# EasyEDA Pro project 电机控制板_v2.1.epro, board PCB11
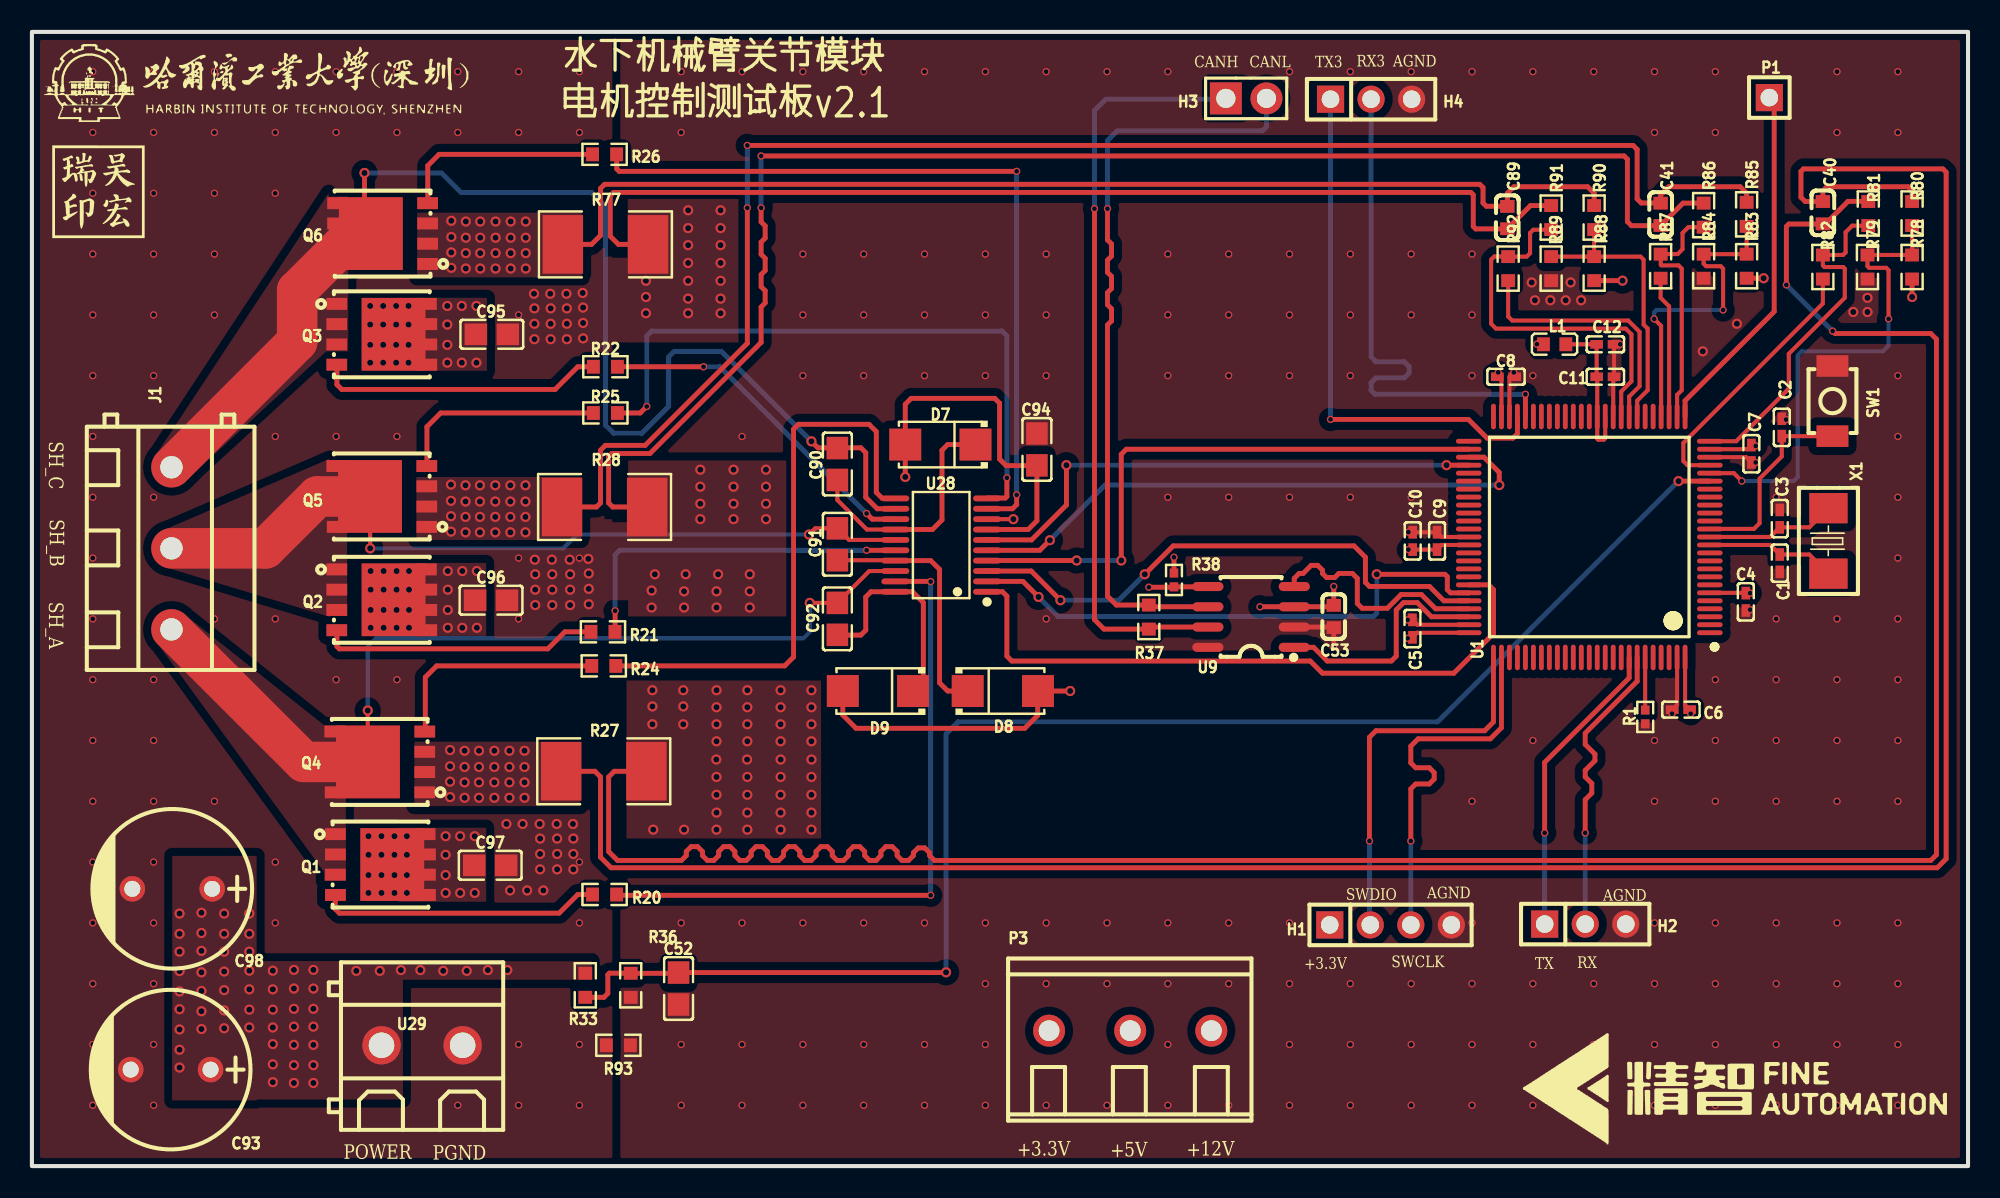
[diagram p3: board, top side]
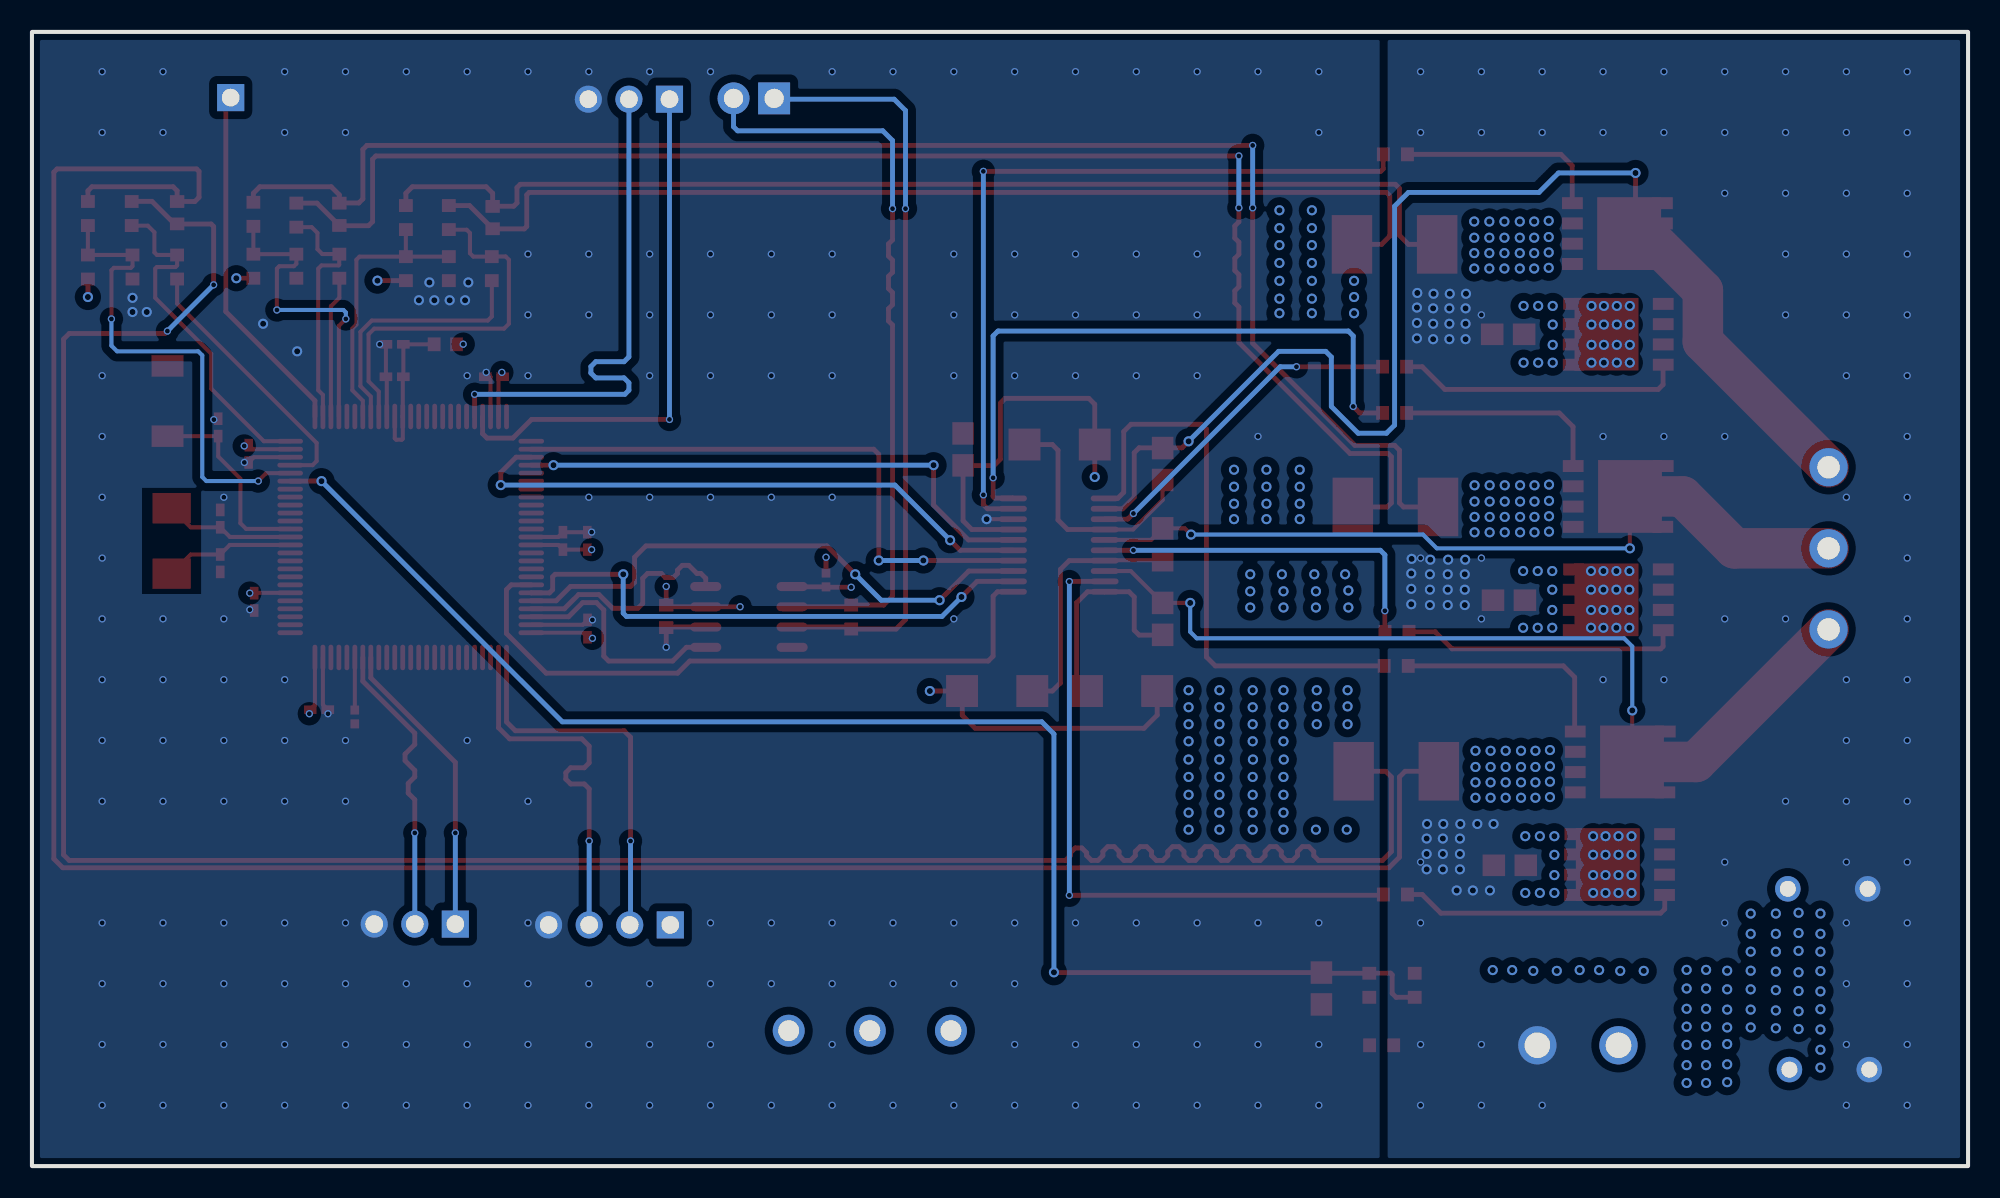
[diagram p4: board, bottom side, seen from below]

Outline 121.26 x 71.07 mm; copper layers: Top Layer, GND, PWR, Bottom Layer. Coordinates in mm from the lower left corner of the outline.
Outline path: rectangle 0,71.07 121.26,0
Stack: Top Layer 0.035mm 外层铜厚1oz / Dielectric1 0.2104mm 7628 RC49% 8.6mil / GND 0.0152mm 内层铜厚 / Dielectric2 1.065mm 1.1mm H/HOZ 含铜 / PWR 0.0152mm 内层铜厚 / Dielectric3 0.2104mm 7628 RC49% 8.6mil / Bottom Layer 0.035mm 外层铜厚1oz

## Design rules (mm)
net RX: USART
net TX: USART
net SWCLK: SWD
net SWDIO: SWD
net CAN_TX: CAN_TR
net CAN_RX: CAN_TR
net OSC_OUT: OSC
net OSC_IN: OSC
net CANH: CAN_HL
net CANL: CAN_HL
template: 自定义配置
spacing copperThickness1oz (default): track to track 0.102, other pairs 0.152 to 0.3
spacing copperThickness2oz: track to track 0.203, other pairs 0.152 to 0.3
track width copperThickness1oz (default): min 0.127, default 0.305, max 2.54
track width copperThickness2oz: min 0.203, default 0.254, max 2.54
differential pair differentialPair (default): width min 0.127, default 0.254, max 2.54; gap min 0.152, default 0.152
via viaSize (default): diameter min 0.254, default 0.457, max 10; hole min 0.3, default 0.305, max 6.299

## Placement (name value [footprint] x y rotation side)
C1  30pF  [C0402]  109.47 37.78 270 top
C2  100nF  [C0402]  109.59 46.29 270 top
C3  30pF  [C0402]  109.47 40.57 90 top
C4  100nF  [C0402]  107.34 35.36 90 top
C5  100nF  [C0402]  86.46 33.68 270 top
C6  100nF  [C0402]  103.28 28.6 0 top
C7  100nF  [C0402]  107.69 44.64 90 top
C8  100nF  [C0402]  92.32 49.46 180 top
C9  100nF  [C0402]  88 39.17 270 top
C10  4.7uF  [C0402]  86.48 39.17 270 top
C11  100nF  [C0402]  98.54 49.46 180 top
C12  1uF  [C0402]  98.54 51.49 180 top
C40  1nF  [C0603]  112.17 59.74 90 top
C41  1nF  [C0603]  102.01 59.64 90 top
C52  100nF  [C0805]  40.5 11.13 90 top
C53  100nF  [C0603]  81.53 34.44 90 top
C89  1nF  [C0603]  92.41 59.44 90 top
C90  200nF  [C0805]  50.44 43.99 270 top
C91  200nF  [C0805]  50.44 38.96 270 top
C92  200nF  [C0805]  50.44 34.29 270 top
C93  100uF  [CAP-TH_BD10.0-P5.00-D0.6-FD]  8.69 6.05 180 top
C94  10uF  [C0805]  62.94 44.91 90 top
C95  220nF  [C0805]  28.8 52.12 0 top
C96  220nF  [C0805]  28.75 35.46 0 top
C97  220nF  [C0805]  28.7 18.85 0 top
C98  100uF  [CAP-TH_BD10.0-P5.00-D0.6-FD]  8.79 17.37 180 top
D7  ES1G  [SMA_L4.3-W2.6-LS5.2-RD]  56.9 45.21 180 top
D8  ES1G  [SMA_L4.3-W2.6-LS5.2-RD]  60.81 29.77 0 top
D9  ES1G  [SMA_L4.3-W2.6-LS5.2-RD]  52.98 29.77 180 top
H1  PZ254V-11-04P  [HDR-TH_4P-P2.54-V-M]  85.09 15.11 0 top
H2  PZ254V-11-03P  [HDR-TH_3P-P2.54-V-M]  97.28 15.16 0 top
H3  PZ254V-11-02P  [HDR-TH_2P-P2.54-V-M]  76.05 66.9 0 top
H4  PZ254V-11-03P  [HDR-TH_3P-P2.54-V-M]  83.87 66.85 0 top
J1  KF128-5.08-3P-AA  [CONN-TH_3P-P5.08_KF128-5.08-3P]  8.74 38.71 270 top
L1  GZ1608D601TF  [L0603]  95.37 51.49 0 top
P1  2.54-1*1P针  [HDR-TH_1P-P2.54-V-M]  108.81 66.95 180 top
P3  WJ500V-5.08-3P  [CONN-TH_3P-P5.00_WJ500V-5.08-3P]  68.78 8.48 180 top
Q1  BSC0702LS  [PG-TDSON-8_L5.0-W6.0-P1.27-BL-EP]  21.83 18.89 270 top
Q2  BSC0702LS  [PG-TDSON-8_L5.0-W6.0-P1.27-BL-EP]  21.91 35.48 270 top
Q3  BSC0702LS  [PG-TDSON-8_L5.0-W6.0-P1.27-BL-EP]  21.91 52.12 270 top
Q4  BSC0702LS  [PG-TDSON-8_L5.0-W6.0-P1.27-BL-EP]  21.78 25.32 90 top
Q5  BSC0702LS  [PG-TDSON-8_L5.0-W6.0-P1.27-BL-EP]  21.91 41.96 90 top
Q6  BSC0702LS  [PG-TDSON-8_L5.0-W6.0-P1.27-BL-EP]  21.96 58.43 90 top
R1  10kΩ  [R0402]  101.04 28.14 270 top
R20  33Ω  [R0603]  35.86 17.02 180 top
R21  33Ω  [R0603]  35.76 33.48 180 top
R22  33Ω  [R0603]  35.92 50.09 180 top
R24  33Ω  [R0603]  35.81 31.34 180 top
R25  33Ω  [R0603]  35.92 47.19 180 top
R26  33Ω  [R0603]  35.86 63.4 180 top
R27  1mΩ  [RES-SMD_L6.4-W3.4]  35.81 24.74 180 top
R28  1mΩ  [RES-SMD_L6.4-W3.4]  35.86 41.3 180 top
R33  75kΩ  [R0603]  34.66 11.33 90 top
R36  3kΩ  [R0603]  37.5 11.33 90 top
R37  120Ω  [R0603]  69.95 34.4 270 top
R38  510Ω  [R0402]  71.53 36.73 90 top
R77  1mΩ  [RES-SMD_L6.4-W3.4]  35.92 57.76 180 top
R78  22kΩ  [R0603]  117.75 56.34 270 top
R79  22kΩ  [R0603]  114.96 56.34 90 top
R80  1.5kΩ  [R0603]  117.75 59.69 270 top
R81  1.5kΩ  [R0603]  115.01 59.69 270 top
R82  11kΩ  [R0603]  112.17 56.34 90 top
R83  22kΩ  [R0603]  107.39 56.39 270 top
R84  22kΩ  [R0603]  104.7 56.39 90 top
R85  1.5kΩ  [R0603]  107.39 59.64 270 top
R86  1.5kΩ  [R0603]  104.7 59.59 270 top
R87  11kΩ  [R0603]  102.01 56.39 90 top
R88  22kΩ  [R0603]  97.84 56.24 270 top
R89  22kΩ  [R0603]  95.15 56.24 90 top
R90  1.5kΩ  [R0603]  97.84 59.44 270 top
R91  1.5kΩ  [R0603]  95.15 59.44 270 top
R92  11kΩ  [R0603]  92.46 56.24 90 top
R93  0Ω  [R0603]  36.73 7.57 0 top
SW1  TS-1185-B-B-B-A  [SW-SMD_L4.0-W3.0-LS5.0]  112.77 47.94 270 top
U1  STM32G474VET6  [LQFP-100_L14.0-W14.0-P0.50-LS16.0-BL]  97.54 39.42 90 top
U9  TJA1050T/CM,118  [SOIC-8_L5.0-W4.0-P1.27-LS6.0-BL]  76.35 34.41 90 top
U28  FD6288T  [TSSOP-20_L6.5-W4.4-P0.65-LS6.4-BL]  56.95 38.91 90 top
U29  KF128-5.08-2P-AA  [CONN-TH_P5.08_KF128-5.08-2P]  24.44 7.57 0 top
X1  8MHz  [CRYSTAL-SMD_L5.0-W3.2]  112.51 39.17 270 top

## Footprints (pads in the part's own frame, mm; a bottom-side part is the same pattern mirrored in y, then rotated)
C0402
  rect 0.79x0.54 smd: 1(-0.545,0) 2(0.545,0)
C0603
  rect 0.8x0.9 smd: 1(-0.7,0) 2(0.7,0)
C0805
  rect 1.41x1.35 smd: 1(-1,0) 2(1,0)
CAP-TH_BD10.0-P5.00-D0.6-FD
  round 1.6 hole 1: 1(-2.5,0) 2(2.5,0)
CONN-TH_3P-P5.00_WJ500V-5.08-3P
  round 2 hole 1.3: 1(-5.08,0) 2(0,0) 3(5.08,0)
CONN-TH_3P-P5.08_KF128-5.08-3P
  round 2.4 hole 1.4: 1(-5.08,0) 2(0,0) 3(5.08,0)
CONN-TH_P5.08_KF128-5.08-2P
  round 2.4 hole 1.6: 1(-2.54,0) 2(2.54,0)
CRYSTAL-SMD_L5.0-W3.2
  rect 1.9x2.4 smd: 1(-2.05,0) 2(2.05,0)
HDR-TH_1P-P2.54-V-M
  rect 1.7x1.7 hole 1.1: 1(0,0)
HDR-TH_2P-P2.54-V-M
  rect 2x2 hole 1.2: 1(-1.27,0)
  round 2 hole 1.2: 2(1.27,0)
HDR-TH_3P-P2.54-V-M
  rect 1.7x1.7 hole 1.1: 1(-2.54,0)
  round 1.7 hole 1.1: 2(0,0) 3(2.54,0)
HDR-TH_4P-P2.54-V-M
  rect 1.7x1.7 hole 1.1: 1(-3.81,0)
  round 1.7 hole 1.1: 2(-1.27,0) 3(1.27,0) 4(3.81,0)
L0603
  rect 0.8x0.864 smd: 1(-0.7,0) 2(0.7,0)
LQFP-100_L14.0-W14.0-P0.50-LS16.0-BL
  oval 0.3x1.6 smd: 1(-6,-7.55) 2(-5.5,-7.55) 3(-5,-7.55) 4(-4.5,-7.55) 5(-4,-7.55) 6(-3.5,-7.55) 7(-3,-7.55) 8(-2.5,-7.55) 9(-2,-7.55) 10(-1.5,-7.55) 11(-1,-7.55) 12(-0.5,-7.55) 13(0,-7.55) 14(0.5,-7.55) 15(1,-7.55) 16(1.5,-7.55) 17(2,-7.55) 18(2.5,-7.55) 19(3,-7.55) 20(3.5,-7.55) 21(4,-7.55) 22(4.5,-7.55) 23(5,-7.55) 24(5.5,-7.55) 25(6,-7.55) 51(6,7.55) 52(5.5,7.55) 53(5,7.55) 54(4.5,7.55) 55(4,7.55) 56(3.5,7.55) 57(3,7.55) 58(2.5,7.55) 59(2,7.55) 60(1.5,7.55) 61(1,7.55) 62(0.5,7.55) 63(0,7.55) 64(-0.5,7.55) 65(-1,7.55) 66(-1.5,7.55) 67(-2,7.55) 68(-2.5,7.55) 69(-3,7.55) 70(-3.5,7.55) 71(-4,7.55) 72(-4.5,7.55) 73(-5,7.55) 74(-5.5,7.55) 75(-6,7.55)
  oval 1.6x0.3 smd: 26(7.55,-6) 27(7.55,-5.5) 28(7.55,-5) 29(7.55,-4.5) 30(7.55,-4) 31(7.55,-3.5) 32(7.55,-3) 33(7.55,-2.5) 34(7.55,-2) 35(7.55,-1.5) 36(7.55,-1) 37(7.55,-0.5) 38(7.55,0) 39(7.55,0.5) 40(7.55,1) 41(7.55,1.5) 42(7.55,2) 43(7.55,2.5) 44(7.55,3) 45(7.55,3.5) 46(7.55,4) 47(7.55,4.5) 48(7.55,5) 49(7.55,5.5) 50(7.55,6) 76(-7.55,6) 77(-7.55,5.5) 78(-7.55,5) 79(-7.55,4.5) 80(-7.55,4) 81(-7.55,3.5) 82(-7.55,3) 83(-7.55,2.5) 84(-7.55,2) 85(-7.55,1.5) 86(-7.55,1) 87(-7.55,0.5) 88(-7.55,0) 89(-7.55,-0.5) 90(-7.55,-1) 91(-7.55,-1.5) 92(-7.55,-2) 93(-7.55,-2.5) 94(-7.55,-3) 95(-7.55,-3.5) 96(-7.55,-4) 97(-7.55,-4.5) 98(-7.55,-5) 99(-7.55,-5.5) 100(-7.55,-6)
PG-TDSON-8_L5.0-W6.0-P1.27-BL-EP
  rect 0.75x1.3 smd: 1(-1.905,-2.82) 2(-0.635,-2.82) 3(0.635,-2.82) 4(1.905,-2.82) 5(1.905,2.82) 6(0.635,2.82) 7(-0.635,2.82) 8(-1.905,2.794)
  rect 4.56x4 smd: 8(0,0.737)
R0402
  rect 0.566x0.54 smd: 1(-0.433,0) 2(0.433,0)
R0603
  rect 0.806x0.864 smd: 1(-0.753,0) 2(0.753,0)
RES-SMD_L6.4-W3.4
  rect 2.535x3.672 smd: 1(-2.667,0) 2(2.667,0)
SMA_L4.3-W2.6-LS5.2-RD
  rect 2x2 smd: 1(-2.2,0) 2(2.2,0)
SOIC-8_L5.0-W4.0-P1.27-LS6.0-BL
  oval 0.569x1.95 smd: 1(-1.905,-2.705) 2(-0.635,-2.705) 3(0.635,-2.705) 4(1.905,-2.705) 5(1.905,2.705) 6(0.635,2.705) 7(-0.635,2.705) 8(-1.905,2.705)
SW-SMD_L4.0-W3.0-LS5.0
  rect 1.35x2 smd: 1(-2.2,0) 2(2.2,0)
TSSOP-20_L6.5-W4.4-P0.65-LS6.4-BL
  oval 0.364x1.742 smd: 1(-2.925,-2.871) 2(-2.275,-2.871) 3(-1.625,-2.871) 4(-0.975,-2.871) 5(-0.325,-2.871) 6(0.325,-2.871) 7(0.975,-2.871) 8(1.625,-2.871) 9(2.275,-2.871) 10(2.925,-2.871) 11(2.925,2.871) 12(2.275,2.871) 13(1.625,2.871) 14(0.975,2.871) 15(0.325,2.871) 16(-0.325,2.871) 17(-0.975,2.871) 18(-1.625,2.871) 19(-2.275,2.871) 20(-2.925,2.871)

## Nets
As in the schematic.

Pads without a net: U1 1 2 3 4 5 7 8 9 10 11 15 16 17 18 19 30 31 38 39 40 41 42 43 44 45 50 51 55 56 57 58 59 60 61 62 65 66 67 68 78 79 80 81 82 83 84 85 86 87 88 89 90 91 92 96 97 98

## Via types
v1: diameter 0.457, hole 0.305, Top Layer to Bottom Layer, 280 vias
v2: diameter 0.635, hole 0.381, Top Layer to Bottom Layer, 372 vias

## Routing (per net, layer and track width the routed paths; a pad name or vN(x,y) marks a point on that pad's centre or on a via; arc(x,y) is an arc through that point)
+3.3V: length 24.4
  Top Layer w0.254: U1.49 92.04,49.53 v1(91.83,49.74) ; U1.24 107.43,44.92 C7.2 ; U1.6 107.32,35.92 C4.2 ; U1.64 88.29,38.92 C9.2 C10.2 v1(86.21,38.63) ; U1.75 86.75,33.42 C5.2 86.4,33.07 v1(86.16,33.07) ; U1.100 103.54,28.89 C6.2 103.89,28.54 v1(103.89,28.35)
  Top Layer w0.305: R78.2 v2(117.75,54.46) ; R88.2 v2(99.62,55.48) ; R38.2 v1(71.53,38.15) ; R83.2 v2(108.46,55.64)
  Bottom Layer w0.305: v1(71.53,38.15) 71.48,38.15
  vias: v1(94.25,51.5) v1(107.62,35.9) v1(107.96,45.13)
+5V: length 5.8
  Top Layer w0.305: v1(76.91,35.05) U9.3 81.44,35.05 C53.2 v1(81.53,36.32)
  Bottom Layer w0.305: v1(76.91,35.05) 76.91,35.05
+12V: length 41.5
  Top Layer w0.305: D9.2 50.78,28.26 51.61,27.43 62.18,27.43 62.99,28.25 62.99,29.75 D8.2 v2(65.02,29.77) ; 59.82,39.89 62.39,39.89 62.94,40.44 C94.1 62.93,43.89 61.01,43.89 60.6,44.3 60.6,47.8 60.3,48.11 55.07,48.11 54.7,47.74 D7.2 v2(54.7,43.18)
AGND: length 27
  Top Layer w0.254: v1(86.16,34.23) C5.1 86.77,33.92 U1.74 ; U1.35 99.04,49.41 C11.1 C12.1 ; U1.63 88.3,39.42 C9.1 C10.1 86.21,39.72 v1(86.21,39.73) ; U1.48 92.54,49.46 v1(92.81,49.74) ; v1(102.72,28.35) 102.72,28.59 C6.1 103.04,28.91 U1.99 ; C7.1 107.36,44.42 U1.23 ; U28.8 v2(61.47,40.54)
  Top Layer w0.305: v1(81.53,32.51) C53.1 81.5,33.78 U9.2
  vias: v1(40.66,68.58) v1(40.66,64.77) v1(40.66,15.24) v1(40.66,7.62) v1(40.66,3.81) v1(44.47,68.58) v1(44.47,45.72) v1(44.47,15.24) v1(44.47,7.62) v1(44.47,3.81) v1(48.28,68.58) v1(48.28,57.15) v1(48.28,53.34) v1(48.28,49.53) v1(48.28,15.24) v1(48.28,7.62) v1(48.28,3.81) v1(52.09,68.58) v1(52.09,57.15) v1(52.09,53.34) v1(52.09,49.53) v1(52.09,15.24) v1(52.09,7.62) v1(52.09,3.81) v1(55.9,68.58) v1(55.9,57.15) v1(55.9,53.34) v1(55.9,49.53) v1(55.9,15.24) v1(55.9,7.62) v1(55.9,3.81) v1(59.71,68.58) v1(59.71,57.15) v1(59.71,53.34) v1(59.71,49.53) v1(59.71,15.24) v1(59.71,11.43) v1(59.71,7.62) v1(59.71,3.81) v1(63.52,68.58) v1(63.52,57.15) v1(63.52,53.34) v1(63.52,49.53) v1(63.52,34.29) v1(63.52,15.24) v1(63.52,11.43) v1(63.52,3.81) v1(67.33,68.58) v1(67.33,15.24) v1(67.33,11.43) v1(67.33,3.81) v1(71.14,68.58) v1(71.14,57.15) v1(71.14,53.34) v1(71.14,49.53) v1(71.14,41.91) v1(71.14,15.24) v1(71.14,11.43) v1(71.14,7.62) v1(71.14,3.81) v1(74.95,57.15) v1(74.95,53.34) v1(74.95,49.53) v1(74.95,41.91) v1(74.95,15.24) v1(74.95,11.43) v1(74.95,3.81) v1(78.76,68.58) v1(78.76,57.15) v1(78.76,53.34) v1(78.76,49.53) v1(78.76,41.91) v1(78.76,15.24) v1(78.76,11.43) v1(78.76,7.62) v1(78.76,3.81) v1(82.57,68.58) v1(82.57,57.15) v1(82.57,53.34) v1(82.57,49.53) v1(82.57,41.91) v1(82.57,11.43) v1(82.57,7.62) v1(82.57,3.81) v1(86.38,68.58) v1(86.38,57.15) v1(86.38,53.34) v1(86.38,41.91) v1(86.38,11.43) v1(86.38,7.62) v1(86.38,3.81) v1(90.19,68.58) v1(90.19,57.15) v1(90.19,53.34) v1(90.19,49.53) v1(90.19,22.86) v1(90.19,15.24) v1(90.19,11.43) v1(90.19,7.62) v1(90.19,3.81) v1(94,68.58) v1(94,49.53) v1(94,26.67) v1(94,11.43) v1(94,7.62) v1(94,3.81) v1(97.81,68.58) v1(97.81,11.43) v1(97.81,7.62) v1(97.81,3.81) v1(99.48,51.49) v1(101.62,68.58) v1(101.62,64.77) v1(101.62,26.67) v1(101.62,22.86) v1(101.62,15.24) v1(101.62,11.43) v1(101.62,7.62) v1(101.62,3.81) v1(105.43,68.58) v1(105.43,64.77) v1(105.43,30.48) v1(105.43,26.67) v1(105.43,22.86) v1(105.43,15.24) v1(105.43,11.43) v1(105.43,7.62) v1(105.43,3.81) v1(107.62,34.87) v1(107.96,44.09) v1(109.24,41.91) v1(109.24,34.29) v1(109.24,30.48) v1(109.24,26.67) v1(109.24,22.86) v1(109.24,15.24) v1(109.24,11.43) v1(109.24,7.62) v1(109.24,3.81) v1(109.87,46.78) v1(113.05,68.58) v1(113.05,64.77) v1(113.05,34.29) v1(113.05,30.48) v1(113.05,26.67) v1(113.05,22.86) v1(113.05,15.24) v1(113.05,11.43) v1(113.05,7.62) v1(113.05,3.81) v1(116.86,68.58) v1(116.86,64.77) v1(116.86,49.53) v1(116.86,45.72) v1(116.86,41.91) v1(116.86,38.1) v1(116.86,34.29) v1(116.86,30.48) v1(116.86,26.67) v1(116.86,22.86) v1(116.86,15.24) v1(116.86,11.43) v1(116.86,7.62) v1(116.86,3.81) v2(93.93,55.37) v2(94.13,54.25) v2(95.1,54.25) v2(96.06,54.25) v2(96.37,55.37) v2(97.02,54.25) v2(104.65,51.05) v2(106.78,52.78) v2(114.07,53.52) v2(114.96,54.41) v2(114.96,53.52)
PGND: length 312
  Top Layer w0.305: v1(45.67,60.05) 45.67,59.17 45.92,58.91 45.92,58.15 45.67,57.9 45.67,57.13 45.92,56.88 45.92,56.12 45.67,55.86 45.67,55.1 45.92,54.85 45.92,54.09 45.67,53.83 45.67,51.61 38.71,44.65 36.32,44.65 36.12,44.45 36.12,41.55 36.37,41.3 R28.1 ; v1(109.88,55.22) 109.88,58.88 110.03,59.03 112.16,59.03 C40.1 112.33,59.04 113.74,60.45 115,60.45 R81.1 ; R27.1 36.47,24.74 36.12,24.38 36.12,19.71 36.68,19.15 40.68,19.15 40.98,19.46 40.98,19.71 41.28,20.02 41.69,20.02 42,19.71 42,19.46 42.3,19.15 42.71,19.15 43.01,19.46 43.01,19.71 43.32,20.02 43.72,20.02 44.03,19.71 44.03,19.46 44.33,19.15 44.74,19.15 45.04,19.46 45.04,19.71 45.35,20.02 45.75,20.02 46.06,19.71 46.06,19.46 46.37,19.15 46.77,19.15 47.08,19.46 47.08,19.71 47.38,20.02 47.79,20.02 48.09,19.71 48.09,19.46 48.4,19.15 48.8,19.15 49.11,19.46 49.11,19.71 49.41,20.02 49.82,20.02 50.12,19.71 50.12,19.46 50.43,19.15 50.84,19.15 51.14,19.46 51.14,19.71 51.44,20.02 51.85,20.02 52.16,19.71 52.16,19.46 52.46,19.15 52.87,19.15 53.17,19.46 53.17,19.71 53.48,20.02 53.88,20.02 54.19,19.71 54.19,19.46 54.49,19.15 54.9,19.15 55.2,19.46 55.2,19.63 55.51,19.94 55.91,19.94 56.22,19.63 56.22,19.46 56.53,19.15 118.92,19.15 119.28,19.51 119.28,51.82 118.92,52.17 112.93,52.17 v1(112.78,52.32) ; R86.1 103.41,60.34 C41.1 102,58.93 100.18,58.93 99.92,59.18 99.92,63.09 99.72,63.3 v1(45.67,63.3) ; R91.1 93.86,60.19 C89.1 92.39,58.72 90.42,58.72 90.27,58.88 90.27,60.86 90.12,61.01 36.42,61.01 36.22,60.81 36.22,58.27 36.73,57.76 R77.1
  Bottom Layer w0.305: v1(112.78,52.32) v1(109.88,55.22) ; v1(45.67,60.05) v1(45.67,63.3)
  vias: v1(3.81,68.58) v1(3.81,64.77) v1(3.81,60.96) v1(3.81,57.15) v1(3.81,53.34) v1(3.81,49.53) v1(3.81,45.72) v1(3.81,41.91) v1(3.81,38.1) v1(3.81,34.29) v1(3.81,30.48) v1(3.81,26.67) v1(3.81,22.86) v1(3.81,19.05) v1(3.81,15.24) v1(3.81,11.43) v1(3.81,7.62) v1(3.81,3.81) v1(7.62,68.58) v1(7.62,64.77) v1(7.62,60.96) v1(7.62,57.15) v1(7.62,53.34) v1(7.62,49.53) v1(7.62,41.91) v1(7.62,30.48) v1(7.62,26.67) v1(7.62,22.86) v1(7.62,19.05) v1(7.62,15.24) v1(7.62,11.43) v1(7.62,7.62) v1(7.62,3.81) v1(11.43,68.58) v1(11.43,64.77) v1(11.43,60.96) v1(11.43,57.15) v1(11.43,53.34) v1(11.43,34.29) v1(11.43,22.86) v1(15.24,68.58) v1(15.24,64.77) v1(15.24,60.96) v1(15.24,45.72) v1(15.24,34.29) v1(15.24,19.05) v1(15.24,15.24) v1(19.05,68.58) v1(19.05,64.77) v1(19.05,45.72) v1(19.05,30.48) v1(22.86,68.58) v1(22.86,64.77) v1(22.86,45.72) v1(22.86,30.48) v1(26.67,68.58) v1(26.67,64.77) v1(26.67,3.81) v1(30.48,68.58) v1(30.48,64.77) v1(30.48,53.34) v1(30.48,38.1) v1(30.48,34.29) v1(30.48,7.62) v1(30.48,3.81) v1(34.29,68.58) v1(34.29,64.77) v1(34.29,38.1) v1(34.29,19.05) v1(34.29,15.24) v1(34.29,7.62) v1(34.29,3.81) v2(29.72,21.44) v2(29.95,17.27) v2(30.73,21.44) v2(31.01,17.27) v2(31.45,54.66) v2(31.47,53.75) v2(31.47,52.78) v2(31.47,51.82) v2(31.5,38) v2(31.52,37.08) v2(31.52,36.12) v2(31.52,35.15) v2(31.8,21.44) v2(31.83,20.52) v2(31.83,19.56) v2(31.83,18.59) v2(32.03,17.27) v2(32.46,54.66) v2(32.49,53.75) v2(32.49,52.78) v2(32.49,51.82) v2(32.56,38) v2(32.59,37.08) v2(32.59,36.12) v2(32.59,35.15) v2(32.87,21.44) v2(32.89,20.52) v2(32.89,19.56) v2(32.89,18.59) v2(33.48,54.66) v2(33.5,53.75) v2(33.5,52.78) v2(33.5,51.82) v2(33.68,38) v2(33.71,37.08) v2(33.71,36.12) v2(33.71,35.15) v2(33.88,21.44) v2(33.91,20.52) v2(33.91,19.56) v2(33.91,18.59) v2(34.49,54.71) v2(34.52,53.8) v2(34.52,52.83) v2(34.52,51.87) v2(34.85,38.05) v2(34.87,37.14) v2(34.87,36.17) v2(34.87,35.2) v2(38.46,55.47) v2(38.46,54.46) v2(38.46,53.44) v2(38.81,36.07) v2(38.81,35) v2(38.86,29.82) v2(38.86,28.8) v2(38.86,27.69) v2(38.91,21.08) v2(39.01,37.08) v2(40.84,36.02) v2(40.84,35) v2(40.79,29.82) v2(40.79,28.8) v2(40.79,27.69) v2(40.84,21.08) v2(40.94,37.08) v2(41.1,59.89) v2(41.1,58.78) v2(41.1,57.71) v2(41.1,56.59) v2(41.1,55.47) v2(41.1,54.36) v2(41.1,53.44) v2(41.86,43.64) v2(41.86,42.57) v2(41.86,41.5) v2(41.86,40.54) v2(42.88,36.02) v2(42.88,35) v2(42.88,29.82) v2(42.88,28.75) v2(42.88,27.69) v2(42.88,26.62) v2(42.86,25.48) v2(42.88,24.38) v2(42.88,23.27) v2(42.88,22.15) v2(42.88,21.08) v2(42.98,37.08) v2(43.13,59.89) v2(43.13,58.78) v2(43.13,57.71) v2(43.13,56.59) v2(43.13,55.47) v2(43.13,54.36) v2(43.13,53.44) v2(43.94,43.64) v2(43.94,42.57) v2(43.94,41.5) v2(43.94,40.54) v2(44.81,29.82) v2(44.81,28.75) v2(44.81,27.69) v2(44.81,26.62) v2(44.79,25.48) v2(44.81,24.38) v2(44.81,23.27) v2(44.81,22.15) v2(44.81,21.08) v2(44.96,37.08) v2(44.96,36.02) v2(44.96,35) v2(45.97,43.64) v2(45.97,42.57) v2(45.97,41.5) v2(45.97,40.54) v2(46.89,29.82) v2(46.89,28.75) v2(46.89,27.69) v2(46.89,26.62) v2(46.89,25.48) v2(46.89,24.38) v2(46.89,23.27) v2(46.89,22.15) v2(46.89,21.08) v2(48.82,29.82) v2(48.82,28.75) v2(48.82,27.69) v2(48.82,26.62) v2(48.82,25.48) v2(48.82,24.38) v2(48.82,23.27) v2(48.82,22.15) v2(48.82,21.08)
VBUS: length 93.3
  Top Layer w0.305: R33.1 35.82,10.57 36.07,10.82 36.07,11.99 36.17,12.09 37.49,12.09 R36.2 40.46,12.08 C52.2 57.24,12.13 v2(57.25,12.14) ; U1.20 v2(103.12,42.92)
  Bottom Layer w0.305: v2(57.25,12.14) 57.25,27.08 58.01,27.84 88.04,27.84 v2(103.12,42.92)
CAN_RX: length 14.9
  Top Layer w0.305: U9.4 79.06,36.83 79.36,37.14 79.61,37.14 80.12,37.64 80.53,37.64 80.83,37.34 80.83,37.14 81.09,36.88 81.59,36.88 81.85,37.14 82.7,37.14 83.01,36.83 83.01,35.26 83.31,34.95 84.89,34.95 85.75,35.81 87.02,35.81 87.91,34.92 U1.72
CAN_TX: length 14.9
  Top Layer w0.305: U9.1 80.27,32.51 81.13,31.65 85.14,31.65 85.45,31.95 85.45,34.85 85.9,35.31 86.77,35.31 87.65,34.42 U1.73
CANH: length 47.8
  Top Layer w0.305: 73.65,33.78 70.08,33.78 R37.2 67.14,33.65 66.55,34.24 v1(66.55,60)
  Bottom Layer w0.305: v1(66.55,60) 66.55,66.14 67.26,66.85 74.73,66.85 H3.1
CANL: length 47.8
  Top Layer w0.305: 73.65,35.05 70.06,35.05 R37.1 67.92,35.16 67.36,35.71 67.36,52.7 67.62,52.96 67.62,53.72 67.36,53.97 67.36,54.73 67.62,54.99 67.62,55.75 67.36,56 67.36,56.77 67.62,57.02 67.62,57.78 67.36,58.04 v1(67.36,60)
  Bottom Layer w0.305: H3.2 77.32,65.13 77.06,64.87 67.97,64.87 67.36,64.26 v1(67.36,60)
DAC: length 22.4
  Top Layer w0.305: U1.26 103.54,47.96 109.12,53.54 109.12,66.65 P1.1
GH_A: length 41.6
  Top Layer w0.305: R20.1 36.67,16.97 v1(56.29,16.97) ; v1(56.29,36.63) 56.28,36.64 U28.19
  Bottom Layer w0.305: v1(56.29,36.63) v1(56.29,16.97)
GH_B: length 22.5
  Top Layer w0.305: v1(36.53,34.8) 36.53,33.49 R21.1 ; U28.16 v1(52.27,38.59)
  Bottom Layer w0.305: v1(36.53,34.8) 36.53,38.3 36.81,38.59 v1(52.27,38.59)
GH_C: length 21.4
  Top Layer w0.305: v1(42.06,50.09) R22.1 ; v1(52.27,40.89) 52.63,40.54 U28.13
  Bottom Layer w0.305: v1(42.06,50.09) 43.08,50.09 v1(52.27,40.89)
GL_A: length 36.3
  Top Layer w0.305: R24.1 47.14,31.34 47.7,31.9 47.7,46.18 48.01,46.48 52.43,46.48 52.88,46.03 52.88,42.22 53.26,41.84 U28.11
GL_B: length 40.6
  Top Layer w0.305: U28.10 59.84,41.86 60.96,41.86 61.06,41.96 v1(61.06,43.13) ; R25.1 38.1,47.19 v1(38.51,47.6)
  Bottom Layer w0.305: v1(38.51,47.6) 38.51,52.02 38.81,52.32 60.76,52.32 61.06,52.02 v1(61.06,43.13)
GL_C: length 48.9
  Top Layer w0.305: U28.9 61.41,41.19 61.68,41.45 61.67,41.46 v1(61.67,42.06) ; v1(61.67,62.33) 36.78,62.33 36.63,62.48 36.63,63.39 R26.1
  Bottom Layer w0.305: v1(61.67,62.33) v1(61.67,42.06)
IA_P: length 154.9
  Top Layer w0.305: R80.1 117.75,61.11 117.5,61.37 112.42,61.37 112.17,61.11 C40.2 111.06,60.44 110.79,60.71 110.79,62.33 110.95,62.48 119.69,62.48 119.89,62.28 119.89,19.25 119.33,18.69 36.27,18.69 35.61,19.36 35.61,24.38 35.26,24.74 R27.2
  vias: v2(26.19,26.07) v2(26.19,25.05) v2(26.19,24.09) v2(26.19,23.12) v2(27.1,26.03) v2(27.1,25.01) v2(27.1,24.04) v2(27.1,23.08) v2(28,26.03) v2(28,25.01) v2(28,24.04) v2(28,23.08) v2(28.96,26.03) v2(28.96,25.01) v2(28.96,24.04) v2(28.96,23.08) v2(29.91,26.03) v2(29.91,25.01) v2(29.91,24.04) v2(29.91,23.08) v2(30.85,26.03) v2(30.85,25.01) v2(30.85,24.04) v2(30.85,23.08)
IB_P: length 97.6
  Top Layer w0.305: R28.2 35.36,41.3 35.61,41.55 35.61,44.86 35.92,45.16 38.41,45.16 44.81,51.56 v1(44.81,60.05) ; R85.1 107.39,60.96 106.98,61.37 102.51,61.37 102.01,60.86 C41.2 102,60.35 100.79,60.35 100.53,60.6 100.53,63.7 100.28,63.96 v1(44.81,63.96)
  Bottom Layer w0.305: v1(44.81,60.05) v1(44.81,63.96)
  vias: v2(26.24,42.7) v2(26.24,41.69) v2(26.24,40.72) v2(26.24,39.76) v2(27.16,42.66) v2(27.16,41.64) v2(27.16,40.68) v2(27.16,39.71) v2(28.06,42.66) v2(28.06,41.64) v2(28.06,40.68) v2(28.06,39.71) v2(29.02,42.66) v2(29.02,41.64) v2(29.02,40.68) v2(29.02,39.71) v2(29.96,42.66) v2(29.96,41.64) v2(29.96,40.68) v2(29.96,39.71) v2(30.91,42.66) v2(30.91,41.64) v2(30.91,40.68) v2(30.91,39.71)
IC_P: length 70.9
  Top Layer w0.305: R90.1 97.84,60.96 97.43,61.37 92.81,61.37 92.41,60.96 C89.2 92.39,60.15 91.08,60.15 90.88,60.35 90.88,61.32 90.68,61.52 35.86,61.52 35.61,61.27 35.61,58.32 35.05,57.76 R77.2
  vias: v2(26.26,59.23) v2(26.26,58.22) v2(26.26,57.25) v2(26.26,56.29) v2(27.17,59.19) v2(27.17,58.17) v2(27.17,57.21) v2(27.17,56.24) v2(28.08,59.19) v2(28.08,58.17) v2(28.08,57.21) v2(28.08,56.24) v2(29.04,59.19) v2(29.04,58.17) v2(29.04,57.21) v2(29.04,56.24) v2(29.98,59.19) v2(29.98,58.17) v2(29.98,57.21) v2(29.98,56.24) v2(30.93,59.19) v2(30.93,58.17) v2(30.93,57.21) v2(30.93,56.24)
INH_A: length 41.5
  Top Layer w0.305: U28.1 60.79,35.99 61.06,35.71 61.06,31.95 61.37,31.65 80.06,31.65 80.82,30.89 89.05,30.89 91.54,33.38 91.54,36.12 91.24,36.42 U1.69
INH_B: length 34.6
  Top Layer w0.305: U1.70 89.98,35.92 88.85,35.92 88.65,36.12 88.65,36.93 88.49,37.08 v2(84.23,37.08) ; U28.2 62.07,36.64 v2(63.04,35.66)
  Bottom Layer w0.305: v2(84.23,37.08) 84.23,34.65 84.02,34.44 64.26,34.44 v2(63.04,35.66)
INH_C: length 34.7
  Top Layer w0.305: v2(64.41,35.46) 62.59,37.29 U28.3 ; U1.71 88.43,35.42 87.53,36.32 83.77,36.32 83.52,36.58 83.52,38.15 82.8,38.86 71.48,38.86 v2(69.7,37.08)
  Bottom Layer w0.305: v2(64.41,35.46) 68.07,35.46 v2(69.7,37.08)
INL_A: length 37
  Top Layer w0.305: v2(65.43,37.95) 59.83,37.95 U28.4 ; v2(68.22,37.95) 68.22,44.6 68.54,44.92 U1.52
  Bottom Layer w0.305: v2(68.22,37.95) v2(65.43,37.95)
INL_B: length 36.9
  Top Layer w0.305: v2(63.75,39.22) 63.12,38.59 U28.5 ; v2(91.9,42.67) 91.9,43.46 90.94,44.42 U1.53
  Bottom Layer w0.305: v2(63.75,39.22) 67.21,42.67 v2(91.9,42.67)
INL_C: length 33.6
  Top Layer w0.305: U28.6 62.61,39.24 64.79,41.42 v2(64.79,43.92) ; U1.54 v2(88.6,43.92)
  Bottom Layer w0.305: v2(64.79,43.92) v2(88.6,43.92)
NRST: length 12.5
  Top Layer w0.254: SW1.2 109.6,45.74 C2.2 109.59,44.47 108.2,43.08 108.2,40.28 107.85,39.93 105.09,39.93 U1.14
OP1_VINM: length 21.7
  Top Layer w0.254: U1.25 106.74,45.42 110.03,48.72 110.03,50.9 113.54,54.41 113.54,56.24 113.44,56.34 112.27,56.34 112.17,56.44 R82.2 113.43,57.09 113.59,57.25 113.59,58.51 114,58.93 115,58.93 R81.2
OP1_VINP: length 30.9
  Top Layer w0.254: v1(107.09,42.93) 106.59,43.42 U1.21 ; R80.2 R78.1 R79.2 114.96,56.39 115.06,56.29 116.13,56.29 116.28,56.13 v1(116.28,53.09)
  Bottom Layer w0.254: v1(107.09,42.93) 110.34,42.93 110.59,43.18 110.59,50.8 110.85,51.05 115.93,51.05 116.28,51.41 v1(116.28,53.09)
OP1_VOUT: length 16.8
  Top Layer w0.254: R82.1 112.17,54.05 103.43,45.31 103.43,44.17 103.68,43.92 U1.22
OP2_VINM: length 15.5
  Top Layer w0.254: U1.27 103.04,48.32 103.33,48.62 103.33,56.24 103.12,56.44 102.06,56.44 102.01,56.48 102.01,57.15 ; R86.2 103.74,58.83 103.38,58.47 103.38,57.45 103.07,57.15 102.01,57.15 ; 102.01,57.15 R87.2
OP2_VINP: length 20.1
  Top Layer w0.254: v1(105.92,53.64) 105.92,56.24 105.77,56.39 104.85,56.39 104.7,56.54 R84.2 R83.1 R85.2 ; v1(101.6,53.09) 102.04,52.65 U1.29
  Bottom Layer w0.254: v1(105.92,53.64) 101.75,53.64 101.6,53.49 v1(101.6,53.09)
OP2_VOUT: length 8.9
  Top Layer w0.254: U1.28 102.54,53.88 102.01,54.41 R87.1
OP3_VINM: length 23.8
  Top Layer w0.254: R91.2 95.14,58.67 94.03,58.67 93.83,58.47 93.83,57.2 93.62,56.99 R92.2 92.45,57 91.59,57 91.39,56.79 91.39,52.78 91.69,52.48 99.82,52.48 100.18,52.12 100.18,49.17 99.54,48.53 U1.34
OP3_VINP: length 17.8
  Top Layer w0.254: U1.32 100.54,47.96 101.19,48.62 101.19,52.48 100.94,52.73 100.94,56.79 100.75,56.99 R88.1 ; R88.1 R89.2 ; R88.1 R90.2
OP3_VOUT: length 16.4
  Top Layer w0.254: R92.1 92.46,53.24 92.71,52.98 99.97,52.98 100.69,52.27 100.69,48.87 100.04,48.22 U1.33
OSC_IN: length 8.2
  Top Layer w0.254: X1.2 111.32,38.32 C1.1 108.87,38.92 U1.12
OSC_OUT: length 8.2
  Top Layer w0.254: U1.13 108.86,39.42 C3.1 111.32,40.03 X1.1
POWER:
  vias: v2(9.25,15.82) v2(9.25,14.55) v2(9.25,13.44) v2(9.25,12.22) v2(9.25,10.95) v2(9.25,9.83) v2(9.25,8.56) v2(9.25,7.29) v2(9.25,6.17) v2(10.62,15.88) v2(10.62,14.61) v2(10.62,13.49) v2(10.62,12.14) v2(10.62,10.97) v2(10.62,9.7) v2(10.62,8.59) v2(12.04,15.82) v2(12.04,14.55) v2(12.04,13.44) v2(12.04,12.19) v2(12.04,11.02) v2(12.04,9.75) v2(12.04,8.64) v2(13.61,15.82) v2(13.61,14.55) v2(13.61,13.44) v2(13.61,12.24) v2(13.61,11.07) v2(13.61,9.8) v2(13.61,8.69) v2(15.09,12.24) v2(15.09,11.07) v2(15.09,9.8) v2(15.09,8.69) v2(15.09,7.65) v2(15.09,6.38) v2(15.09,5.26) v2(16.41,12.29) v2(16.41,11.13) v2(16.41,9.86) v2(16.41,8.74) v2(16.41,7.59) v2(16.41,6.32) v2(16.41,5.21) v2(17.63,12.29) v2(17.63,11.13) v2(17.63,9.86) v2(17.63,8.74) v2(17.63,7.59) v2(17.63,6.32) v2(17.63,5.21) v2(20.31,12.23) v2(21.08,20.67) v2(21.08,19.5) v2(21.08,18.23) v2(21.08,17.12) v2(21.18,53.9) v2(21.18,52.73) v2(21.18,51.46) v2(21.18,50.34) v2(21.21,37.29) v2(21.21,36.12) v2(21.21,34.85) v2(21.21,33.73) v2(21.79,12.23) v2(21.89,20.67) v2(21.89,19.5) v2(21.89,18.23) v2(21.89,17.12) v2(22,53.9) v2(22,52.73) v2(22,51.46) v2(22,50.34) v2(22.03,37.29) v2(22.03,36.12) v2(22.03,34.85) v2(22.03,33.73) v2(22.7,20.67) v2(22.7,19.5) v2(22.7,18.23) v2(22.7,17.12) v2(22.81,53.9) v2(22.81,52.73) v2(22.81,51.46) v2(22.81,50.34) v2(22.84,37.29) v2(22.84,36.12) v2(22.84,34.85) v2(22.84,33.73) v2(23.11,12.28) v2(23.48,20.67) v2(23.48,19.5) v2(23.48,18.23) v2(23.48,17.12) v2(23.59,53.9) v2(23.59,52.73) v2(23.59,51.46) v2(23.59,50.34) v2(23.62,37.29) v2(23.62,36.12) v2(23.62,34.85) v2(23.62,33.73) v2(24.33,12.28) v2(25.76,12.23) v2(25.91,20.67) v2(25.91,19.5) v2(25.91,18.23) v2(25.91,17.12) v2(26.02,53.9) v2(26.02,52.73) v2(26.02,51.46) v2(26.02,50.34) v2(26.04,37.29) v2(26.04,36.12) v2(26.04,34.85) v2(26.04,33.73) v2(26.82,20.67) v2(26.82,17.12) v2(26.92,53.9) v2(26.92,50.34) v2(26.95,37.29) v2(26.95,33.73) v2(27.23,12.23) v2(27.73,20.67) v2(27.73,17.12) v2(27.84,53.9) v2(27.84,50.34) v2(27.87,37.29) v2(27.87,33.73) v2(28.55,12.28) v2(29.77,12.28)
RX: length 18.9
  Top Layer w0.305: v1(97.28,20.88) 97.28,22.96 97.69,23.37 97.69,23.98 97.28,24.39 97.28,24.8 97.89,25.41 97.89,25.81 97.28,26.42 97.28,27.13 100.54,30.38 U1.94
  Bottom Layer w0.305: v1(97.28,20.88) H2.2
RX3: length 33.4
  Top Layer w0.305: U1.46 v1(93.54,48.36)
  Bottom Layer w0.305: v1(93.54,48.36) 84.12,48.36 83.87,48.62 83.87,49.08 84.18,49.39 85.95,49.39 86.25,49.69 86.25,50.1 85.95,50.4 84.18,50.4 83.87,50.71 H4.2
SH_A: length 59.1
  Top Layer w0.254: U28.18 52.44,37.29 C92.1 v2(48.72,35.29) ; Q4.8 21.03,25.34 v2(21.03,28.55)
  Top Layer w2.54: J1.3 17.04,25.32 Q4.8
  Bottom Layer w0.254: v2(48.72,35.29) 48.72,33.48 48.31,33.07 21.54,33.07 21.03,32.56 v2(21.03,28.55)
SH_B: length 50.8
  Top Layer w0.254: v2(21.18,38.71) 21.18,41.95 Q5.8 ; U28.15 51.17,39.24 C91.1 49.06,39.96 v2(48.67,39.57)
  Top Layer w2.54: J1.2 14.63,38.71 17.88,41.96 Q5.8
  Bottom Layer w0.254: v2(48.67,39.57) 34.14,39.57 33.27,38.71 v2(21.18,38.71)
SH_C: length 82.1
  Top Layer w0.305: Q6.8 20.83,58.83 v2(20.83,62.23) ; U28.12 52.94,41.19 52.22,41.91 52.22,44.7 51.92,45.01 50.46,45.01 ; 50.46,45.01 C90.1 ; 50.46,45.01 49.23,45.01 v2(48.82,45.42)
  Top Layer w2.54: Q6.8 20.18,58.43 16.61,54.86 16.61,51.66 J1.1
  Bottom Layer w0.305: v2(48.82,45.42) 43.18,51.05 40.23,51.05 39.88,50.7 39.88,47.6 38.2,45.92 36.42,45.92 35.92,46.43 35.92,60.15 35.05,61.01 26.87,61.01 25.65,62.23 v2(20.83,62.23)
SWCLK: length 24
  Top Layer w0.305: v1(86.36,20.37) 86.36,23.64 86.66,23.94 87.52,23.94 87.82,24.25 87.82,24.66 87.52,24.96 86.66,24.96 86.36,25.27 86.36,26.31 86.82,26.77 91.34,26.77 92.04,27.47 U1.77
  Bottom Layer w0.305: v1(86.36,20.37) H1.3
SWDIO: length 24
  Top Layer w0.305: v1(83.77,20.37) 83.77,26.87 84.18,27.28 90.98,27.28 91.54,27.83 U1.76
  Bottom Layer w0.305: v1(83.77,20.37) 83.77,15.16 H1.2
TX: length 18.9
  Top Layer w0.305: v1(94.74,20.88) 94.74,25.3 100.04,30.59 U1.93
  Bottom Layer w0.305: v1(94.74,20.88) H2.1
TX3: length 33.4
  Top Layer w0.305: v1(81.33,46.79) 89.97,46.79 91.14,45.62 92.76,45.62 93.04,45.89 U1.47
  Bottom Layer w0.305: v1(81.33,46.79) H4.1
$1N2896: length 9.8
  Top Layer w0.254: U1.36 98.54,45.6 98.45,45.52 98.09,45.52 98.04,45.58 U1.37 98.04,49.42 C11.2 C12.2 L1.2
$1N3277: length 3.3
  Top Layer w0.254: R1.1 101.04,28.58 U1.95
$5N9514: length 17.6
  Top Layer w0.305: R20.2 34.19,17.02 33.02,15.85 19.25,15.85 19,16.1 19,16.98 Q1.4
$5N9618: length 14.1
  Top Layer w0.305: R24.2 25.35,31.34 24.64,30.63 24.64,27.26 Q4.4
$5N10412: length 17.4
  Top Layer w0.305: Q2.4 19.1,33.57 19.1,32.56 19.25,32.41 32.31,32.41 33.38,33.48 R21.2
$5N10417: length 13.2
  Top Layer w0.305: R25.2 25.6,47.19 24.74,46.33 24.74,43.88 Q5.4
$5N10865: length 18
  Top Layer w0.305: R22.2 34.19,50.09 32.77,48.67 19.41,48.67 19.1,48.97 19.1,50.21 Q3.4
$5N10870: length 13
  Top Layer w0.305: 24.78,60.34 24.79,60.35 24.79,62.69 25.5,63.4 R26.2
$5N19775: length 3.7
  Top Layer w0.305: 73.65,36.32 73.63,36.3 71.53,36.3 71.5,36.27 v1(69.95,36.27)
$5N68095: length 15.4
  Top Layer w0.254: C90.2 50.44,41.74 52.3,39.89 54.08,39.89
  Top Layer w0.305: 54.08,39.89 56.4,39.89 57,40.49 57,44.86 57.35,45.21 D7.1
$5N68096: length 15.7
  Top Layer w0.254: U28.17 54.05,37.96 C91.2
  Top Layer w0.305: U28.17 56.3,37.94 56.85,37.39 56.85,30.28 57.35,29.77 D8.1
$5N68097: length 13.8
  Top Layer w0.305: C92.2 50.46,33.27 51.92,33.27 52.22,33.58 52.22,35.66 52.55,35.99 U28.20 55.15,35.99 55.83,35.31 55.83,30.41 D9.1

## Copper pours and planes (outline as drawn; the poured copper is in the pictures)
+3.3V on PWR: 36.23,70.57 120.76,70.57 120.76,0.5 36.23,0.5
+5V on PWR: 66.86,38 82.66,38 82.66,4.11 66.86,4.11
+12V on PWR: 36.42,70.57 76.05,70.57 76.05,6.6 36.42,6.6
AGND on Top Layer: 36.85,71.07 121.26,71.07 121.26,0 36.85,0
AGND on Bottom Layer: 36.85,71.07 121.26,71.07 121.26,0 36.85,0
AGND on GND: 36.98,70.57 120.76,70.57 120.76,0.5 36.98,0.5
PGND on Top Layer: 0,71.07 121.26,71.07 121.26,0 0,0
PGND on Top Layer: 35.92,56.91 37.65,56.91 37.65,51.61 35.92,51.61
PGND on Top Layer: 37.34,44.21 47.24,44.21 47.24,34.44 37.34,34.44
PGND on Top Layer: 37.24,30.43 49.43,30.43 49.43,20.52 37.24,20.52
PGND on Top Layer: 36.08,40.35 37.8,40.35 37.8,35.46 36.08,35.46
PGND on Top Layer: 37.32,60.6 44.25,60.6 44.25,51.61 37.32,51.61
PGND on Bottom Layer: 0,71.07 121.26,71.07 121.26,0 0,0
PGND on GND: 0.5,70.57 50.46,70.57 50.46,0.5 0.5,0.5
IA_P on Top Layer: 23.95,26.59 34.34,26.59 34.34,22.56 23.95,22.56
IB_P on Top Layer: 24.08,43.18 34.39,43.18 34.39,39.24 24.08,39.24
IC_P on Top Layer: 24.13,59.74 34.44,59.74 34.44,55.69 24.13,55.69
POWER on Top Layer: 23.01,54.41 28.5,54.41 28.5,49.83 23.01,49.83
POWER on Top Layer: 8.79,19.44 14.07,19.44 14.07,4.12 8.79,4.12
POWER on Top Layer: 22.93,21.2 28.45,21.2 28.45,16.56 22.93,16.56
POWER on Top Layer: 13.67,12.84 35.06,12.84 35.06,11.67 13.67,11.67
POWER on Top Layer: 23.01,37.8 28.45,37.8 28.45,33.22 23.01,33.22
POWER on Top Layer: 8.79,9.35 23.23,9.35 23.23,4.17 8.79,4.17
POWER on Top Layer: 13.67,12.84 23.23,12.84 23.23,7.59 13.67,7.59
POWER on PWR: 0.5,70.57 35.92,70.57 35.92,0.5 0.5,0.5
SH_A on Top Layer: 7.92,34.67 18.69,34.67 18.69,17.88 7.92,17.88
SH_A on Top Layer: 18.29,27.64 19.66,27.64 19.66,17.88 18.29,17.88
SH_B on Top Layer: 8.13,44.33 18.64,44.33 18.64,34.41 8.13,34.41
SH_B on Top Layer: 18.44,44.24 19.74,44.24 19.74,34.47 18.44,34.47
SH_C on Top Layer: 18.44,60.76 19.81,60.76 19.81,51.05 18.44,51.05
SH_C on Top Layer: 7.82,60.99 18.59,60.99 18.59,42.82 7.82,42.82

Small or netless copper shapes (teardrops, artwork), in the pictures only: 2 on Top Layer

## Text on the board
Top Silkscreen Layer: CANH | CANL | +3.3V | TX3 | SWDIO | RX3 | SWCLK | AGND | TX | RX | SH_C | SH_A | SH_B | POWER | PGND | +5V | +12V | 水下机械臂关节模块 / 电机控制测试板v2.1
